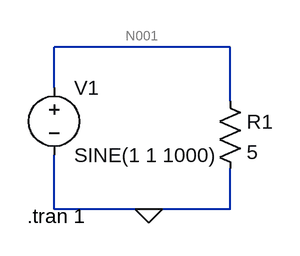
[diagram p0: schematic fmcw_pcb.asc]
fmcw_pcb.asc, the LTspice schematic file:
Version 4
SHEET 1 880 680
WIRE 240 48 32 48
WIRE 32 96 32 48
WIRE 240 112 240 48
WIRE 32 240 32 176
WIRE 144 240 32 240
WIRE 240 240 240 192
WIRE 240 240 144 240
FLAG 144 240 0
SYMBOL voltage 32 80 R0
WINDOW 123 0 0 Left 0
WINDOW 39 0 0 Left 0
SYMATTR InstName V1
SYMATTR Value SINE(1 1 1000)
SYMBOL res 224 96 R0
SYMATTR InstName R1
SYMATTR Value 5
TEXT 0 248 Left 2 !.tran 1

The netlist it stands for:
* fmcw_pcb.asc
V1 N001 0 SINE(1 1 1000)
R1 N001 0 5
.tran 1
.backanno
.end

* Results of the author's LTspice run, read from the files saved beside the schematic
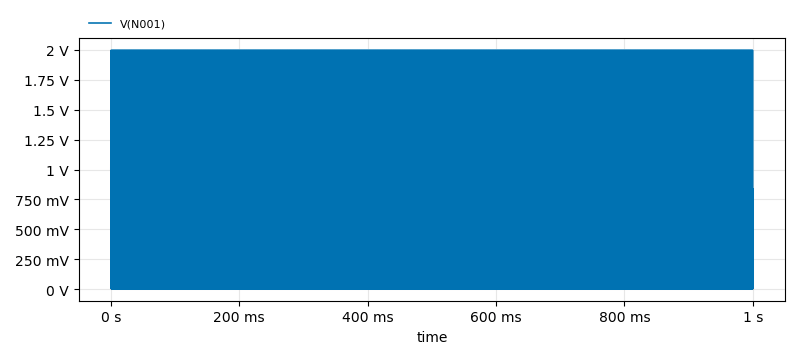
[diagram p1: Transient Analysis of fmcw_pcb.asc, plotted from the saved traces]
* Transient Analysis, 1 run:
*   V(N001): min 466.8 µV, max 2 V, average 1 V, rms 1.232 V, last 1 V